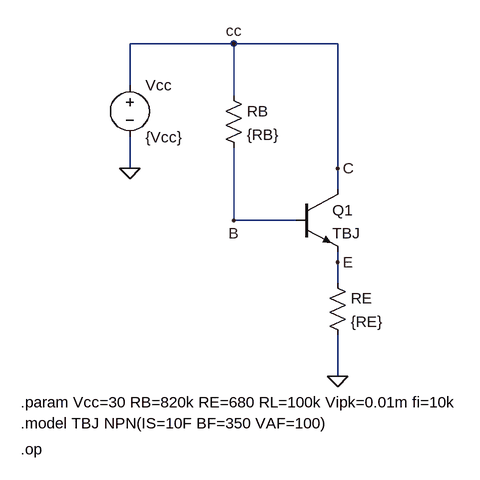
[diagram p0: schematic TBJ03CAop.asc]
TBJ03CAop.asc, the LTspice schematic file:
Version 4
SHEET 1 1608 1200
WIRE 128 -16 -32 -16
WIRE 288 -16 128 -16
WIRE -32 48 -32 -16
WIRE 128 64 128 -16
WIRE -32 176 -32 128
WIRE 288 176 288 -16
WIRE 288 208 288 176
WIRE 128 256 128 144
WIRE 224 256 128 256
WIRE 288 320 288 304
WIRE 288 352 288 320
WIRE 288 496 288 432
FLAG -32 176 0
FLAG 288 496 0
FLAG 128 -16 cc
FLAG 128 256 B
FLAG 288 176 C
FLAG 288 320 E
SYMBOL res 112 48 R0
SYMATTR InstName RB
SYMATTR Value {RB}
SYMBOL voltage -32 32 R0
WINDOW 123 0 0 Left 0
WINDOW 39 0 0 Left 0
SYMATTR InstName Vcc
SYMATTR Value {Vcc}
SYMBOL npn 224 208 R0
SYMATTR InstName Q1
SYMATTR Value TBJ
SYMBOL res 272 336 R0
SYMATTR InstName RE
SYMATTR Value {RE}
TEXT -200 608 Left 2 !.op
TEXT -200 536 Left 2 !.param Vcc=30 RB=820k RE=680 RL=100k Vipk=0.01m fi=10k
TEXT -200 568 Left 2 !.model TBJ NPN(IS=10F BF=350 VAF=100)

The netlist it stands for:
* TBJ03CAop.asc
RB C B {RB}
Vcc C 0 {Vcc}
Q1 C B E 0 TBJ
RE E 0 {RE}
.model NPN NPN
.model PNP PNP
.lib standard.bjt
.op
.param Vcc=30 RB=820k RE=680 RL=100k Vipk=0.01m fi=10k
.model TBJ NPN(IS=10F BF=350 VAF=100)
.backanno
.end